# EAGLE board StearnsN2 (EAGLE 6.6.0)
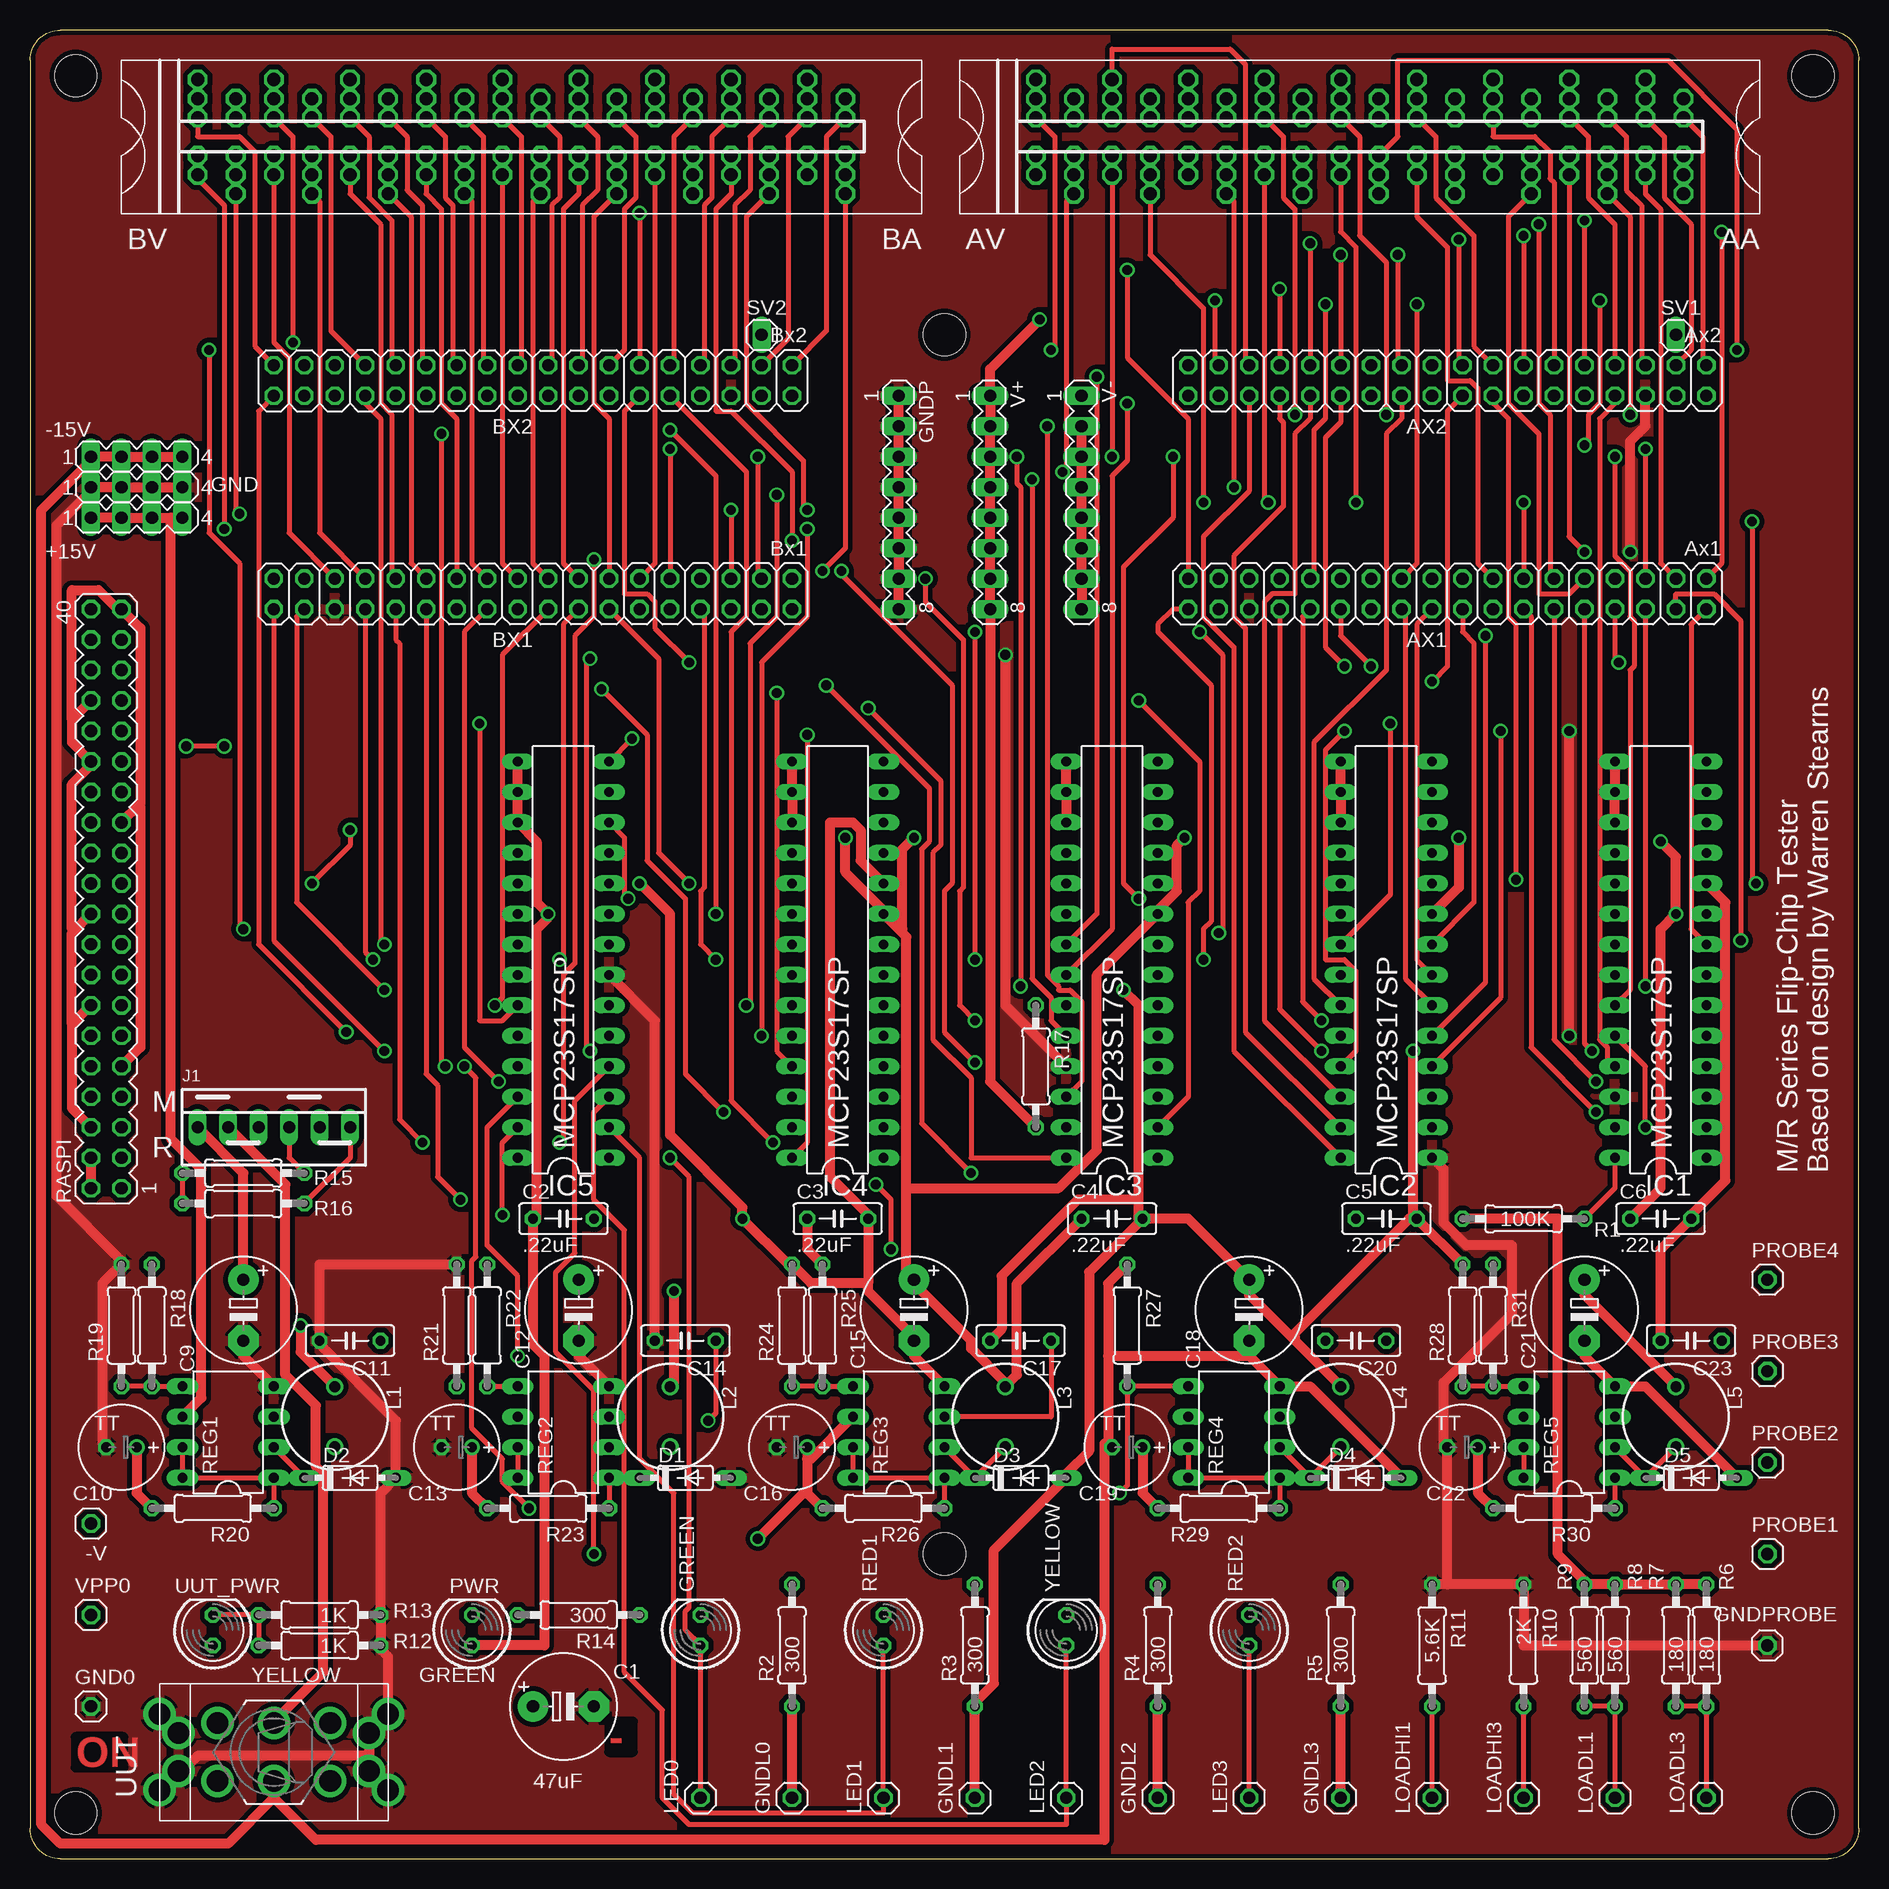
[diagram p1: board, top side]
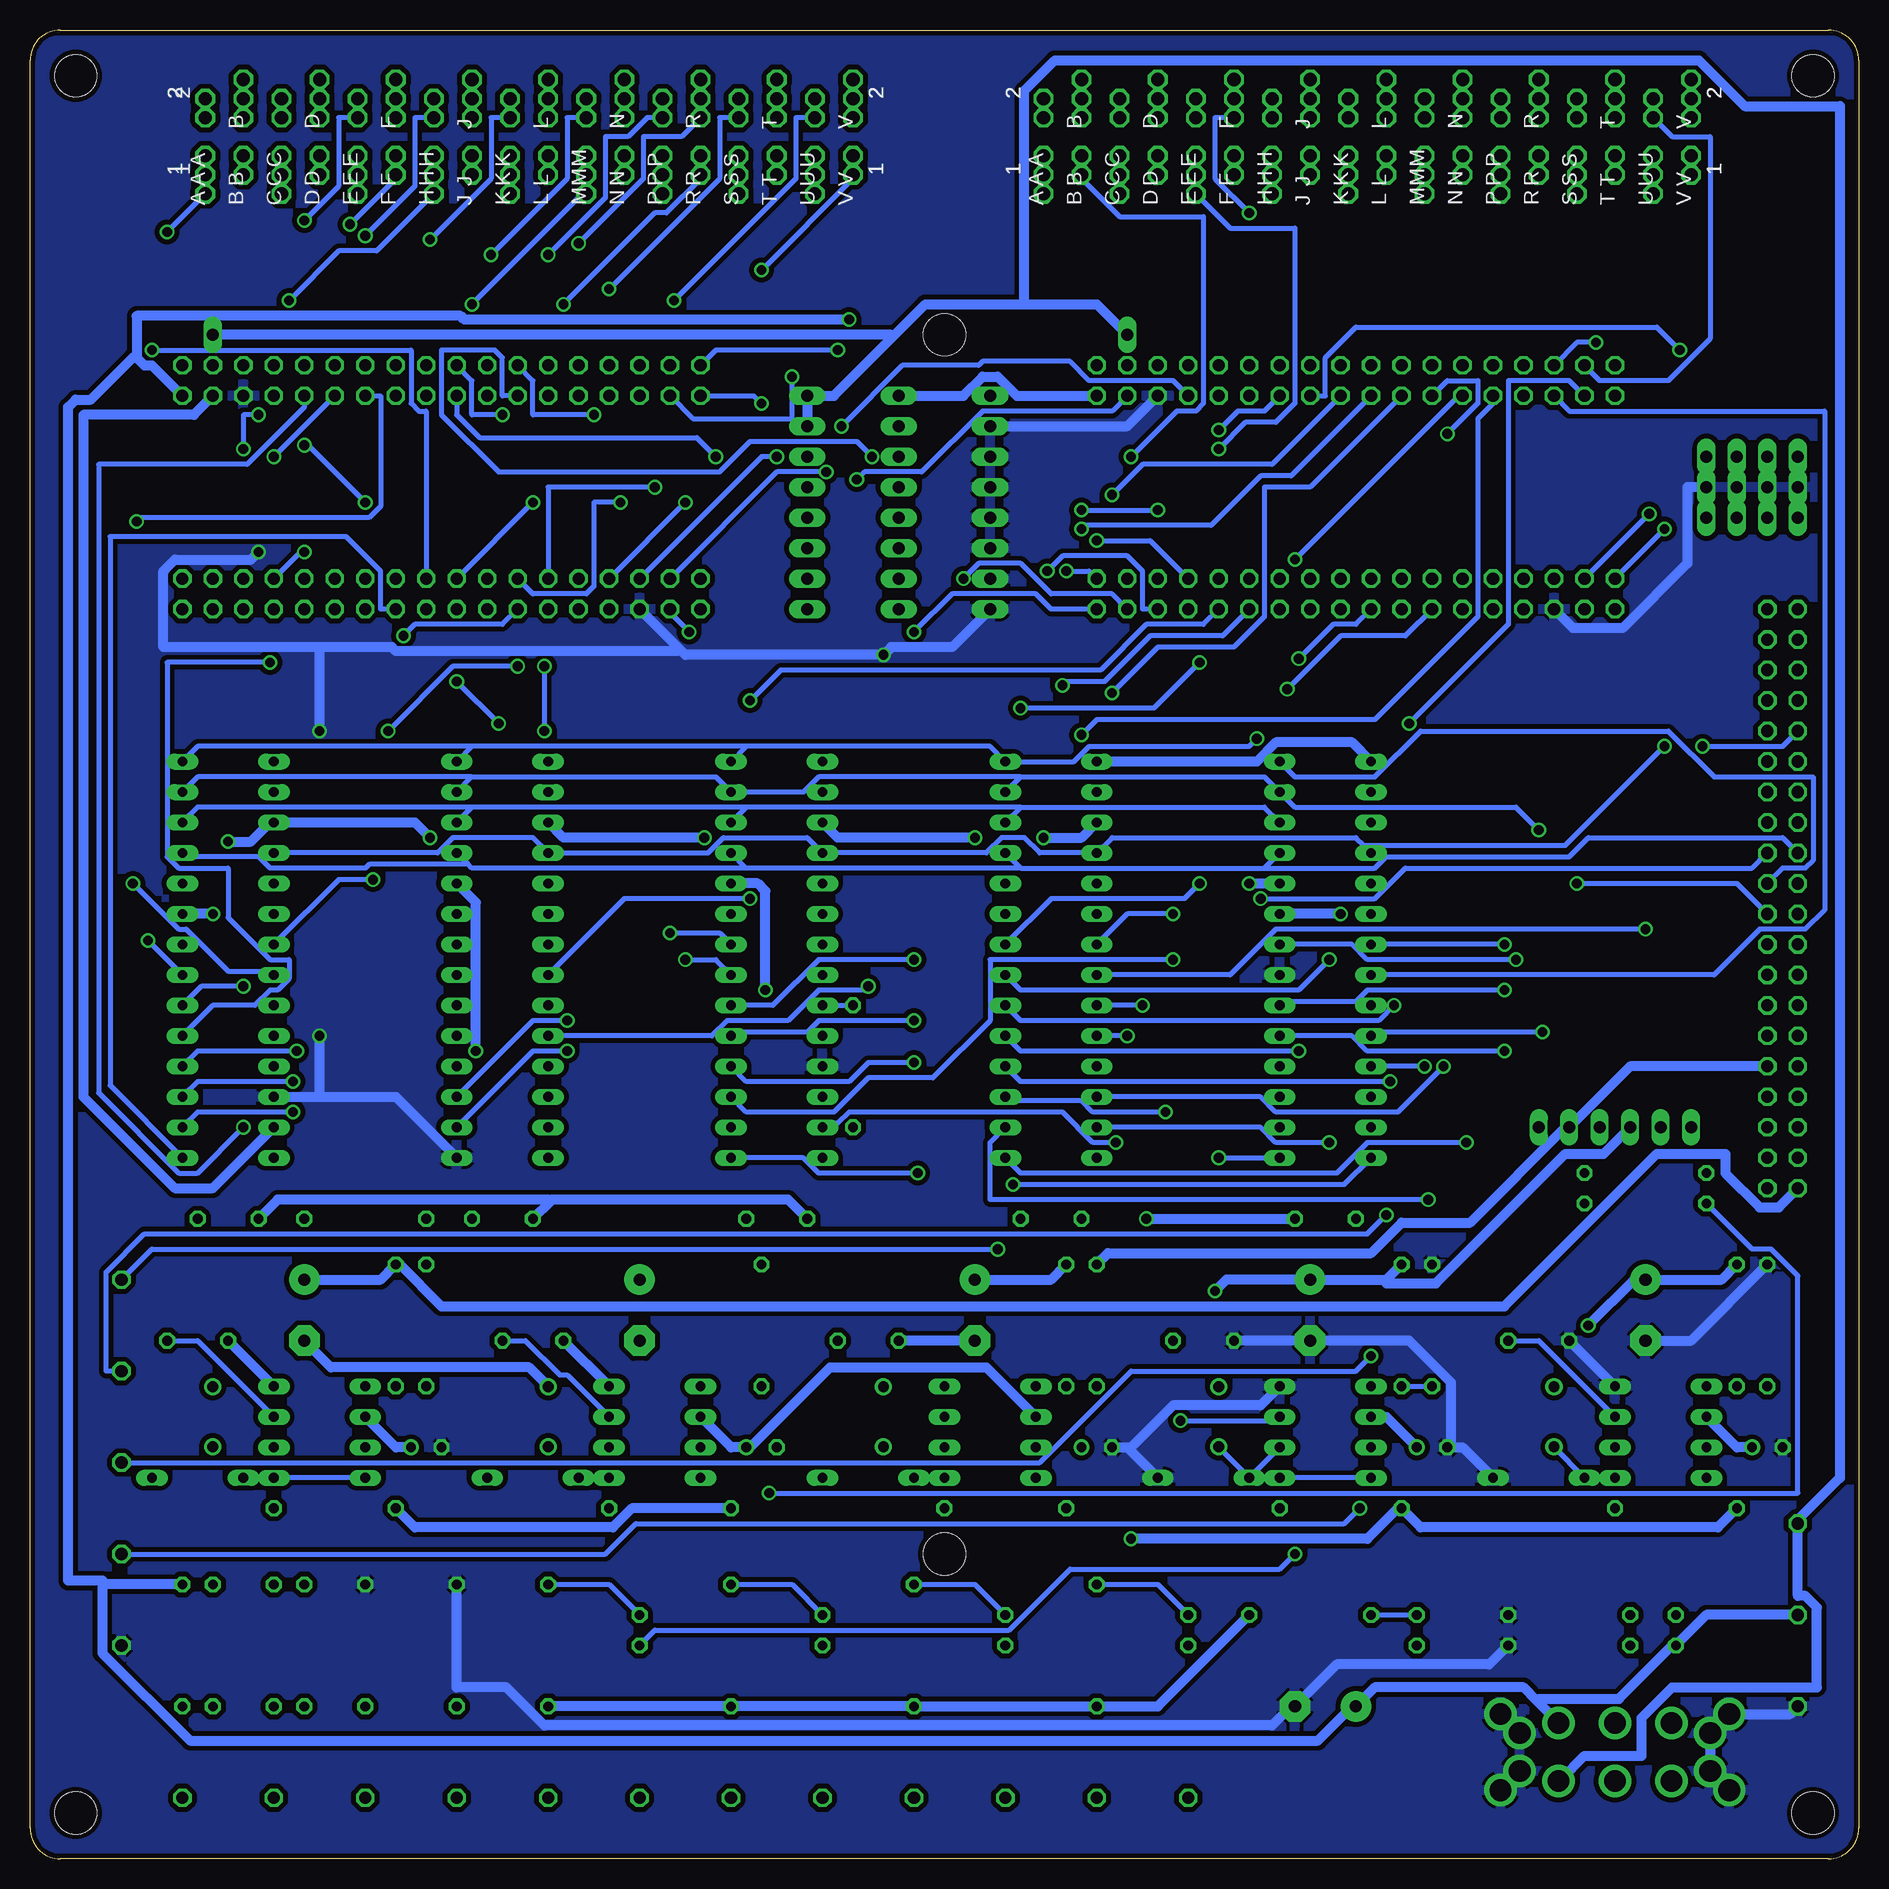
[diagram p2: board, bottom side, seen from below]

Size 152.4 x 152.4 mm. Coordinates in mm from the lower left corner, seen from the top.
Outline: 149.86,152.4 2.54,152.4 arc90 0,149.86 0,2.54 arc90 2.54,0 149.86,0 arc90 152.4,2.54 152.4,149.86 arc90 149.86,152.4
Copper layers (1+16): Top 0.035mm / dielectric 1.5mm / Bottom 0.035mm
Design rules "16mils *": minimum track width 16mil, minimum drill 32mil, track to track 15mil, track to pad 10mil, pad to pad 10mil, via to via 10mil, smd to smd 10mil, copper to edge 13mil, drill to drill 10mil, minimum pad ring 10mil, minimum via ring 8mil, stop-mask expansion 0mil, vias tented up to drill 0mil, thermal gap 10mil
Net classes: 1 Supply: width 0.813 mm
Holes 3.51 mm at 148.59,148.59 3.81,148.59 3.81,3.81 148.59,3.81 76.2,127 76.2,25.4
vRestrict: area 144.8,57.1 to 149.9,97.8

## Footprints (pad centres in the part's own frame; a part is rotated, then mirrored left to right if it is on the bottom)
MA04-1 = drill 1.016 long: 1 -3.81,0; 2 -1.27,0; 3 1.27,0; 4 3.81,0
1X01 = drill 1.016 octagon: 1 0,0
2X18 = drill 1.016 octagon: 1 -21.59,-1.27; 2 -21.59,1.27; 3 -19.05,-1.27; 4 -19.05,1.27; 5 -16.51,-1.27; 6 -16.51,1.27; 7 -13.97,-1.27; 8 -13.97,1.27; 9 -11.43,-1.27; 10 -11.43,1.27; 11 -8.89,-1.27; 12 -8.89,1.27; 13 -6.35,-1.27; 14 -6.35,1.27; 15 -3.81,-1.27; 16 -3.81,1.27; 17 -1.27,-1.27; 18 -1.27,1.27; 19 1.27,-1.27; 20 1.27,1.27; 21 3.81,-1.27; 22 3.81,1.27; 23 6.35,-1.27; 24 6.35,1.27; 25 8.89,-1.27; 26 8.89,1.27; 27 11.43,-1.27; 28 11.43,1.27; 29 13.97,-1.27; 30 13.97,1.27; 31 16.51,-1.27; 32 16.51,1.27; 33 19.05,-1.27; 34 19.05,1.27; 35 21.59,-1.27; 36 21.59,1.27
E5-8,5 = drill 1.016 pad 2.54: + -2.54,0 | drill 1.016 pad 2.54 octagon: - 2.54,0
C050-025X075 = drill 0.813 octagon: 1 -2.54,0; 2 2.54,0
TT2D7 = drill 0.813: + -1.27,0 | drill 0.813 octagon: - 1.27,0
DO35-7 = drill 0.813 long: A 3.81,0; C -3.81,0
H807-2 = drill 1.092 octagon: AA1 4.763,60.325; AA2 -1.587,60.325; AB1 1.587,57.15; AB2 -4.763,57.15; AC1 4.763,53.975; AC2 -1.587,53.975; AD1 1.587,50.8; AD2 -4.763,50.8; AE1 4.763,47.625; AE2 -1.587,47.625; AF1 1.587,44.45; AF2 -4.763,44.45; AH1 4.763,41.275; AH2 -1.587,41.275; AJ1 1.587,38.1; AJ2 -4.763,38.1; AK1 4.763,34.925; AK2 -1.587,34.925; AL1 1.587,31.75; AL2 -4.763,31.75; AM1 4.763,28.575; AM2 -1.587,28.575; AN1 1.587,25.4; AN2 -4.763,25.4; AP1 4.763,22.225; AP2 -1.587,22.225; AR1 1.587,19.05; AR2 -4.763,19.05; AS1 4.763,15.875; AS2 -1.587,15.875; AT1 1.587,12.7; AT2 -4.763,12.7; AU1 4.763,9.525; AU2 -1.587,9.525; AV1 1.587,6.35; AV2 -4.763,6.35; BA1 4.763,-9.525; BA2 -1.587,-9.525; BB1 1.587,-12.7; BB2 -4.763,-12.7; BC1 4.763,-15.875; BC2 -1.587,-15.875; BD1 1.587,-19.05; BD2 -4.763,-19.05; BE1 4.763,-22.225; BE2 -1.587,-22.225; BF1 1.587,-25.4; BF2 -4.763,-25.4; BH1 4.763,-28.575; BH2 -1.587,-28.575; BJ1 1.587,-31.75; BJ2 -4.763,-31.75; BK1 4.763,-34.925; BK2 -1.587,-34.925; BL1 1.587,-38.1; BL2 -4.763,-38.1; BM1 4.763,-41.275; BM2 -1.587,-41.275; BN1 1.587,-44.45; BN2 -4.763,-44.45; BP1 4.763,-47.625; BP2 -1.587,-47.625; BR1 1.587,-50.8; BR2 -4.763,-50.8; BS1 4.763,-53.975; BS2 -1.587,-53.975; BT1 1.587,-57.15; BT2 -4.763,-57.15; BU1 4.763,-60.325; BU2 -1.587,-60.325; BV1 1.587,-63.5; BV2 -4.763,-63.5
ECS2418-2 = drill 1.092 octagon: AA1 1.587,60.325; AA2 -1.587,60.325; AB1 1.587,57.15; AB2 -1.587,57.15; AC1 1.587,53.975; AC2 -1.587,53.975; AD1 1.587,50.8; AD2 -1.587,50.8; AE1 1.587,47.625; AE2 -1.587,47.625; AF1 1.587,44.45; AF2 -1.587,44.45; AH1 1.587,41.275; AH2 -1.587,41.275; AJ1 1.587,38.1; AJ2 -1.587,38.1; AK1 1.587,34.925; AK2 -1.587,34.925; AL1 1.587,31.75; AL2 -1.587,31.75; AM1 1.587,28.575; AM2 -1.587,28.575; AN1 1.587,25.4; AN2 -1.587,25.4; AP1 1.587,22.225; AP2 -1.587,22.225; AR1 1.587,19.05; AR2 -1.587,19.05; AS1 1.587,15.875; AS2 -1.587,15.875; AT1 1.587,12.7; AT2 -1.587,12.7; AU1 1.587,9.525; AU2 -1.587,9.525; AV1 1.587,6.35; AV2 -1.587,6.35; BA1 1.587,-9.525; BA2 -1.587,-9.525; BB1 1.587,-12.7; BB2 -1.587,-12.7; BC1 1.587,-15.875; BC2 -1.587,-15.875; BD1 1.587,-19.05; BD2 -1.587,-19.05; BE1 1.587,-22.225; BE2 -1.587,-22.225; BF1 1.587,-25.4; BF2 -1.587,-25.4; BH1 1.587,-28.575; BH2 -1.587,-28.575; BJ1 1.587,-31.75; BJ2 -1.587,-31.75; BK1 1.587,-34.925; BK2 -1.587,-34.925; BL1 1.587,-38.1; BL2 -1.587,-38.1; BM1 1.587,-41.275; BM2 -1.587,-41.275; BN1 1.587,-44.45; BN2 -1.587,-44.45; BP1 1.587,-47.625; BP2 -1.587,-47.625; BR1 1.587,-50.8; BR2 -1.587,-50.8; BS1 1.587,-53.975; BS2 -1.587,-53.975; BT1 1.587,-57.15; BT2 -1.587,-57.15; BU1 1.587,-60.325; BU2 -1.587,-60.325; BV1 1.587,-63.5; BV2 -1.587,-63.5
EDAC346-36-2 = drill 1.092 octagon: AA1 3.175,60.325; AA2 -3.175,60.325; AB1 3.175,57.15; AB2 -3.175,57.15; AC1 3.175,53.975; AC2 -3.175,53.975; AD1 3.175,50.8; AD2 -3.175,50.8; AE1 3.175,47.625; AE2 -3.175,47.625; AF1 3.175,44.45; AF2 -3.175,44.45; AH1 3.175,41.275; AH2 -3.175,41.275; AJ1 3.175,38.1; AJ2 -3.175,38.1; AK1 3.175,34.925; AK2 -3.175,34.925; AL1 3.175,31.75; AL2 -3.175,31.75; AM1 3.175,28.575; AM2 -3.175,28.575; AN1 3.175,25.4; AN2 -3.175,25.4; AP1 3.175,22.225; AP2 -3.175,22.225; AR1 3.175,19.05; AR2 -3.175,19.05; AS1 3.175,15.875; AS2 -3.175,15.875; AT1 3.175,12.7; AT2 -3.175,12.7; AU1 3.175,9.525; AU2 -3.175,9.525; AV1 3.175,6.35; AV2 -3.175,6.35; BA1 3.175,-9.525; BA2 -3.175,-9.525; BB1 3.175,-12.7; BB2 -3.175,-12.7; BC1 3.175,-15.875; BC2 -3.175,-15.875; BD1 3.175,-19.05; BD2 -3.175,-19.05; BE1 3.175,-22.225; BE2 -3.175,-22.225; BF1 3.175,-25.4; BF2 -3.175,-25.4; BH1 3.175,-28.575; BH2 -3.175,-28.575; BJ1 3.175,-31.75; BJ2 -3.175,-31.75; BK1 3.175,-34.925; BK2 -3.175,-34.925; BL1 3.175,-38.1; BL2 -3.175,-38.1; BM1 3.175,-41.275; BM2 -3.175,-41.275; BN1 3.175,-44.45; BN2 -3.175,-44.45; BP1 3.175,-47.625; BP2 -3.175,-47.625; BR1 3.175,-50.8; BR2 -3.175,-50.8; BS1 3.175,-53.975; BS2 -3.175,-53.975; BT1 3.175,-57.15; BT2 -3.175,-57.15; BU1 3.175,-60.325; BU2 -3.175,-60.325; BV1 3.175,-63.5; BV2 -3.175,-63.5
MA08-1 = drill 1.016 long: 1 -8.89,0; 2 -6.35,0; 3 -3.81,0; 4 -1.27,0; 5 1.27,0; 6 3.81,0; 7 6.35,0; 8 8.89,0
LED5MM = drill 0.813 octagon: A -1.27,0; K 1.27,0
DIL28-3 = drill 0.813 long: 1 -16.51,-3.81; 2 -13.97,-3.81; 3 -11.43,-3.81; 4 -8.89,-3.81; 5 -6.35,-3.81; 6 -3.81,-3.81; 7 -1.27,-3.81; 8 1.27,-3.81; 9 3.81,-3.81; 10 6.35,-3.81; 11 8.89,-3.81; 12 11.43,-3.81; 13 13.97,-3.81; 14 16.51,-3.81; 15 16.51,3.81; 16 13.97,3.81; 17 11.43,3.81; 18 8.89,3.81; 19 6.35,3.81; 20 3.81,3.81; 21 1.27,3.81; 22 -1.27,3.81; 23 -3.81,3.81; 24 -6.35,3.81; 25 -8.89,3.81; 26 -11.43,3.81; 27 -13.97,3.81; 28 -16.51,3.81
22-23-2061 = drill 1 long: 1 -6.35,0; 2 -3.81,0; 3 -1.27,0; 4 1.27,0; 5 3.81,0; 6 6.35,0
6000-XXXX-RC = drill 0.9 pad 1.422: 1 -2.5,0; 2 2.5,0
0207/10 = drill 0.813 octagon: 1 -5.08,0; 2 5.08,0
MA20-2 = drill 1.016 octagon: 1 -24.13,-1.27; 2 -24.13,1.27; 3 -21.59,-1.27; 4 -21.59,1.27; 5 -19.05,-1.27; 6 -19.05,1.27; 7 -16.51,-1.27; 8 -16.51,1.27; 9 -13.97,-1.27; 10 -13.97,1.27; 11 -11.43,-1.27; 12 -11.43,1.27; 13 -8.89,-1.27; 14 -8.89,1.27; 15 -6.35,-1.27; 16 -6.35,1.27; 17 -3.81,-1.27; 18 -3.81,1.27; 19 -1.27,-1.27; 20 -1.27,1.27; 21 1.27,-1.27; 22 1.27,1.27; 23 3.81,-1.27; 24 3.81,1.27; 25 6.35,-1.27; 26 6.35,1.27; 27 8.89,-1.27; 28 8.89,1.27; 29 11.43,-1.27; 30 11.43,1.27; 31 13.97,-1.27; 32 13.97,1.27; 33 16.51,-1.27; 34 16.51,1.27; 35 19.05,-1.27; 36 19.05,1.27; 37 21.59,-1.27; 38 21.59,1.27; 39 24.13,-1.27; 40 24.13,1.27
DIL08 = drill 0.813 long: 1 -3.81,-3.81; 2 -1.27,-3.81; 3 1.27,-3.81; 4 3.81,-3.81; 5 3.81,3.81; 6 1.27,3.81; 7 -1.27,3.81; 8 -3.81,3.81
MA01-1 = drill 1.016 long: 1 0,0
7209MD9V3 = drill 1.803: 1 -2.413,4.699; 2 -2.413,0; 3 -2.413,-4.699; 4 2.413,4.699; 5 2.413,0; 6 2.413,-4.699; NC@1 -3.175,9.525; NC@2 -1.587,7.938; NC@3 3.175,9.525; NC@4 1.587,7.938; NC@5 -3.175,-9.525; NC@6 -1.587,-7.938; NC@7 1.587,-7.938; NC@8 3.175,-9.525

## Placement (x,y rotation side)
+15V  +15V  [MA04-1]  8.89,111.76 0 top
-15V  -15V  [MA04-1]  8.89,116.84 0 top
-V  [1X01]  5.08,27.94 180 top
AX1  Ax1  [2X18]  118.11,105.41 180 top
AX2  Ax2  [2X18]  118.11,123.19 180 top
BX1  Bx1  [2X18]  41.91,105.41 180 top
BX2  Bx2  [2X18]  41.91,123.19 180 top
C1  47uF  [E5-8,5]  44.45,12.7 0 top
C2  .22uF  [C050-025X075]  44.45,53.34 0 top
C3  .22uF  [C050-025X075]  67.31,53.34 0 top
C4  .22uF  [C050-025X075]  90.17,53.34 0 top
C5  .22uF  [C050-025X075]  113.03,53.34 0 top
C6  .22uF  [C050-025X075]  135.89,53.34 0 top
C9  470uF  [E5-8,5]  17.78,45.72 270 top
C10  100uF  [TT2D7]  7.62,34.29 180 top
C11  .22uF  [C050-025X075]  26.67,43.18 180 top
C12  470uF  [E5-8,5]  45.72,45.72 270 top
C13  100uF  [TT2D7]  35.56,34.29 180 top
C14  .22uF  [C050-025X075]  54.61,43.18 180 top
C15  470uF  [E5-8,5]  73.66,45.72 270 top
C16  100uF  [TT2D7]  63.5,34.29 180 top
C17  .22uF  [C050-025X075]  82.55,43.18 180 top
C18  470uF  [E5-8,5]  101.6,45.72 270 top
C19  100uF  [TT2D7]  91.44,34.29 180 top
C20  .22uF  [C050-025X075]  110.49,43.18 180 top
C21  470uF  [E5-8,5]  129.54,45.72 270 top
C22  100uF  [TT2D7]  119.38,34.29 180 top
C23  .22uF  [C050-025X075]  138.43,43.18 180 top
D1  1N5819  [DO35-7]  54.61,31.75 0 top
D2  1N5819  [DO35-7]  26.67,31.75 0 top
D3  1N5819  [DO35-7]  82.55,31.75 0 top
D4  1N5819  [DO35-7]  110.49,31.75 0 top
D5  1N5819  [DO35-7]  138.43,31.75 0 top
DEC  W971  [H807-2]  77.47,143.51 270 top
ECS  W971ECS  [ECS2418-2]  77.47,143.51 270 top
EDAC  W971EDAC  [EDAC346-36-2]  77.47,143.51 270 top
GND  GND  [MA04-1]  8.89,114.3 0 top
GND0  [1X01]  5.08,12.7 0 top
GNDL0  [1X01]  63.5,5.08 90 top
GNDL1  [1X01]  78.74,5.08 90 top
GNDL2  [1X01]  93.98,5.08 90 top
GNDL3  [1X01]  109.22,5.08 90 top
GNDP  GND  [MA08-1]  72.39,113.03 270 top
GNDPROBE  [1X01]  144.78,17.78 180 top
GREEN  [LED5MM]  55.88,19.05 90 top
IC1  MCP23S17SP  [DIL28-3]  135.89,74.93 90 top
IC2  MCP23S17SP  [DIL28-3]  113.03,74.93 90 top
IC3  MCP23S17SP  [DIL28-3]  90.17,74.93 90 top
IC4  MCP23S17SP  [DIL28-3]  67.31,74.93 90 top
IC5  MCP23S17SP  [DIL28-3]  44.45,74.93 90 top
J1  CONFIG  [22-23-2061]  20.32,60.96 0 top
L1  220uH  [6000-XXXX-RC]  25.4,36.83 90 top
L2  220uH  [6000-XXXX-RC]  53.34,36.83 90 top
L3  220uH  [6000-XXXX-RC]  81.28,36.83 90 top
L4  220uH  [6000-XXXX-RC]  109.22,36.83 90 top
L5  220uH  [6000-XXXX-RC]  137.16,36.83 90 top
LED0  [1X01]  55.88,5.08 90 top
LED1  [1X01]  71.12,5.08 90 top
LED2  [1X01]  86.36,5.08 90 top
LED3  [1X01]  101.6,5.08 90 top
LOADHI1  [1X01]  116.84,5.08 90 top
LOADHI3  [1X01]  124.46,5.08 90 top
LOADL1  [1X01]  132.08,5.08 90 top
LOADL3  [1X01]  139.7,5.08 90 top
PROBE1  [1X01]  144.78,25.4 0 top
PROBE2  [1X01]  144.78,33.02 0 top
PROBE3  [1X01]  144.78,40.64 0 top
PROBE4  [1X01]  144.78,48.26 0 top
PWR  GREEN  [LED5MM]  36.83,19.05 90 top
R1  100K  [0207/10]  124.46,53.34 180 top
R2  300  [0207/10]  63.5,17.78 90 top
R3  300  [0207/10]  78.74,17.78 90 top
R4  300  [0207/10]  93.98,17.78 90 top
R5  300  [0207/10]  109.22,17.78 90 top
R6  180  [0207/10]  139.7,17.78 90 top
R7  180  [0207/10]  137.16,17.78 90 top
R8  560  [0207/10]  132.08,17.78 90 top
R9  560  [0207/10]  129.54,17.78 90 top
R10  2K  [0207/10]  124.46,17.78 270 top
R11  5.6K  [0207/10]  116.84,17.78 270 top
R12  1K  [0207/10]  24.13,17.78 180 top
R13  1K  [0207/10]  24.13,20.32 180 top
R14  300  [0207/10]  45.72,20.32 180 top
R15  13.2K  [0207/10]  17.78,57.15 0 top
R16  9.8K  [0207/10]  17.78,54.61 0 top
R17  100K  [0207/10]  83.82,66.04 270 top
R18  1.2K  [0207/10]  7.62,44.45 270 top
R19  3.6K  [0207/10]  10.16,44.45 90 top
R20  0.33  [0207/10]  15.24,29.21 0 top
R21  1.2K  [0207/10]  35.56,44.45 270 top
R22  8.4K  [0207/10]  38.1,44.45 90 top
R23  0.33  [0207/10]  43.18,29.21 0 top
R24  1.2K  [0207/10]  63.5,44.45 270 top
R25  2K  [0207/10]  66.04,44.45 90 top
R26  0.33  [0207/10]  71.12,29.21 0 top
R27  1.2K  [0207/10]  91.44,44.45 270 top
R28  1.2K  [0207/10]  119.38,44.45 270 top
R29  0.33  [0207/10]  99.06,29.21 0 top
R30  0.33  [0207/10]  127,29.21 0 top
R31  3.6K  [0207/10]  121.92,44.45 90 top
RASPI  RasPi  [MA20-2]  6.35,80.01 90 top
RED1  [LED5MM]  71.12,19.05 90 top
RED2  [LED5MM]  101.6,19.05 90 top
REG1  MC33063/MC34063P  [DIL08]  16.51,35.56 90 top
REG2  MC33063/MC34063P  [DIL08]  44.45,35.56 90 top
REG3  MC33063/MC34063P  [DIL08]  72.39,35.56 90 top
REG4  MC33063/MC34063P  [DIL08]  100.33,35.56 90 top
REG5  MC33063/MC34063P  [DIL08]  128.27,35.56 90 top
SV1  MA01-1  [MA01-1]  137.16,127 0 top
SV2  MA01-1  [MA01-1]  60.96,127 0 top
UUT  720X  [7209MD9V3]  20.32,8.89 90 top
UUT_PWR  YELLOW  [LED5MM]  15.24,19.05 90 top
V+  V+  [MA08-1]  80.01,113.03 270 top
V-  V-  [MA08-1]  87.63,113.03 270 top
VPP0  [1X01]  5.08,20.32 0 top
YELLOW  [LED5MM]  86.36,19.05 90 top

## Tracks (layer width: path | path; a pad name or v marks a point on that pad's centre or on a via)
!CE0!/GPIO8
  Bottom 0.406: 49.53,82.55 IC5.11 | 69.85,82.55 49.53,82.55 | IC4.11 69.85,82.55 | 92.71,82.55 IC3.11 | 69.85,82.55 92.71,82.55 | 115.89,82.87 115.57,82.55 92.71,82.55 | 115.89,82.87 IC2.11 | IC1.11 139.38,83.5 133.35,83.5 132.4,82.55 124.46,82.55 124.14,82.87 115.89,82.87 | RASPI.24 6.35,85.09 22.54,85.09 24.13,83.5 39.37,83.5 40.32,82.55 49.53,82.55
!RESET!/GPIO12  (via drill 0.81)
  Top 0.406: v16.19,92.71 v13.02,92.71
  Bottom 0.406: IC1.18 118.43,83.82 117.16,85.09 110.49,85.09 IC2.18 95.89,83.82 94.61,85.09 87.63,85.09 IC3.18 72.71,83.82 71.44,85.09 69.53,85.09 68.26,83.82 IC4.18 62.23,85.09 41.91,85.09 41.27,84.45 | 41.27,84.45 IC5.18 | RASPI.32 6.35,92.71 v13.02,92.71 | v16.19,92.71 24.45,84.45 41.27,84.45
+5V  (via drill 0.81)
  Top 0.813: v22.54,44.45 22.54,42.23 25.4,39.37 L1.2 | J1.1 17.78,57.15 C9.+
  Bottom 0.813: R19.2 11.43,48.26 C9.+ 18.73,48.26 v22.54,44.45
+10V  (via drill 0.81)
  Top 0.813: v53.66,47.31 53.66,39.69 53.34,39.37 L2.2
  Bottom 0.813: 39.37,48.26 R22.2 | 39.37,48.26 C12.+ 52.7,48.26 v53.66,47.31 | J1.3 21.27,58.74 24.45,58.74 35.24,47.94 39.37,47.94 39.37,48.26
+15V  (via drill 0.81)
  Top 0.813: R30.1 120.65,30.48 C22.+ | 64.77,30.48 R26.1 | C16.+ 64.77,33.34 | 64.77,33.34 64.77,30.48 | REG3.6 65.09,33.34 64.77,33.34 | R29.1 92.71,30.48 C19.+ | R23.1 36.83,30.48 C13.+ | +15V.1 +15V.2 +15V.3 11.75,111.76 | 11.75,111.76 +15V.4 | R20.1 8.89,30.48 C10.+ | 11.75,111.76 11.75,60.01 14.29,57.47 14.29,38.42 REG1.6 | v60.64,26.67 64.45,30.48 64.77,30.48
  Bottom 0.813: REG5.6 121.92,34.29 C22.+ | REG4.6 93.98,34.29 C19.+ 92.39,34.29 85.72,40.96 72.71,40.96 REG3.6 | R30.1 120.33,27.62 103.82,27.62 102.23,29.21 R29.1 | C13.+ 39.37,36.83 REG2.6 | REG1.6 10.16,34.29 C10.+ | R20.1 11.75,27.62 36.51,27.62 R23.1 38.42,29.21 40.96,26.67 v60.64,26.67
-15V
  Top 0.813: 101.6,41.91 REG4.4 106.68,39.37 D4.A | C18.- 101.6,41.91 | -15V.4 -15V.3 -15V.2 -15V.1 5.08,116.52 0.95,112.39 0.95,2.86 2.54,1.27 16.51,1.27 20.32,5.08 | 89.85,34.61 C19.- | 89.85,41.91 89.85,47.94 R27.1 | 89.85,41.91 89.85,34.61 | 20.32,5.08 23.81,1.59 89.53,1.59 89.53,34.61 89.85,34.61 | 20.32,5.08 UUT.2 | 89.85,41.91 101.6,41.91
  Bottom 0.813: REG4.4 C20.2
AA1J
  Top 0.406: IC1.8 138.43,77.47 138.43,102.87 AX1.2
AB1J  (via drill 0.81)
  Top 0.406: v142.56,76.52 142.56,103.19 140.34,105.41 137.16,105.41 AX1.4
  Bottom 0.406: v142.56,76.52 IC1.7
AB2J
  Bottom 0.813: IC1.27 137.16,55.88 140.34,55.88 147.96,63.5 147.96,120.33 138.75,120.33 AX2.4
AC1J  (via drill 0.81)
  Top 0.406: AX1.6 v134.62,72.71
  Bottom 0.406: IC1.6 138.11,72.71 v134.62,72.71
AD1J  (via drill 0.81)
  Top 0.406: v132.4,99.69 132.08,100.01 AX1.8
  Bottom 0.406: IC1.5 137.16,71.12 133.67,71.12 132.4,72.39 131.76,72.39 130.81,73.34 130.81,74.93 132.4,74.93 135.89,78.42 135.89,82.55 140.02,82.55 140.97,83.5 140.97,99.69 v132.4,99.69
AD2J
  Top 0.406: IC1.25 131.44,66.67 131.44,67.63 130.81,68.26 130.81,120.02 132.08,121.28 AX2.8
AE1J  (via drill 0.81)
  Top 0.406: v130.18,67.31 129.54,67.94 AX1.10
  Bottom 0.406: IC1.4 138.43,67.31 v130.18,67.31
AE2J  (via drill 0.81)
  Top 0.406: IC1.24 134.62,66.04 v134.62,60.96
  Bottom 0.406: v134.62,60.96 138.43,57.15 140.02,57.15 146.69,63.82 146.69,116.2 134.3,116.2 129.54,120.97 AX2.10
AF1J  (via drill 0.81)
  Top 0.406: v130.49,64.77 127,68.26 AX1.12
  Bottom 0.406: IC1.3 138.43,64.77 v130.49,64.77
AF2J  (via drill 0.81)
  Top 0.406: IC1.23 133.35,72.39 133.35,99.06 133.67,99.38 133.67,103.19 133.35,103.5 133.35,107.31 132.08,108.58 v132.08,116.84
  Bottom 0.406: AX2.12 v132.08,116.84
AH1J  (via drill 0.81)
  Top 0.406: v130.49,62.23 125.09,67.63 125.09,103.5 AX1.14
  Bottom 0.406: IC1.2 138.43,62.23 v130.49,62.23
AH2J  (via drill 0.81)
  Top 0.406: v143.83,81.28 143.51,81.6 v143.51,111.44
  Bottom 0.406: IC1.22 132.4,73.98 135.89,73.98 139.38,77.47 140.02,77.47 v143.83,81.28 | v143.51,111.44 143.19,111.76 124.14,111.76 123.19,112.71 123.19,121.92 AX2.14
AJ1J
  Bottom 0.406: IC1.1 145.73,64.45 145.73,110.17 126.05,110.17 123.19,107.31 123.19,104.14 AX1.16
AJ2J  (via drill 0.81)
  Top 0.406: v123.83,81.6 123.83,102.87 123.19,103.5 123.19,120.02 121.92,121.28 AX2.16
  Bottom 0.406: IC1.21 126.68,81.6 v123.83,81.6
AK1J
  Top 0.406: IC2.8 120.33,79.69 120.33,101.28 119.38,102.23 AX1.18
AK2J  (via drill 0.81)
  Top 0.406: IC2.21 113.35,80.33 v113.35,94.61 | v116.84,98.11 118.11,99.38 118.11,120.65 AX2.18
  Bottom 0.406: v116.84,98.11 v113.35,94.61
AL1J
  Top 0.406: IC2.7 115.57,74.93 115.57,102.87 AX1.20
AL2J  (via drill 0.81)
  Top 0.406: v92.39,80.01 91.12,81.28 91.12,107.63 95.25,111.76 v95.25,116.84
  Bottom 0.406: IC2.22 102.87,80.01 v92.39,80.01 | v95.25,116.84 96.84,118.43 114.94,118.43 116.84,120.33 AX2.20
AM1J
  Top 0.406: IC2.6 114.62,73.34 114.62,103.82 AX1.22
AM2J
  Top 0.406: IC2.23 107,73.34 107,93.03 113.03,99.06 113.03,118.75 114.3,120.02 AX2.22
AN1J  (via drill 0.81)
  Top 0.406: IC2.5 121.28,73.03 v121.28,101.92
  Bottom 0.406: v121.28,101.92 120.33,102.87 113.03,102.87 AX1.24
AN2J  (via drill 0.81)
  Top 0.406: v82.55,72.71 82.55,114.3 82.23,114.62 v82.23,116.84
  Bottom 0.406: IC2.24 95.57,68.58 94.3,69.85 89.22,69.85 86.68,72.39 82.87,72.39 v82.55,72.71 | v82.23,116.84 83.5,118.11 92.39,118.11 94.93,115.57 113.35,115.57 118.11,120.33 118.11,125.73 113.67,125.73 113.03,125.09 113.03,121.92 AX2.24
AP1J  (via drill 0.81)
  Top 0.406: IC2.4 122.56,71.75 v122.56,93.98 | v111.76,99.38 109.22,101.92 AX1.26
  Bottom 0.406: v122.56,93.98 117.16,99.38 v111.76,99.38
AP2J  (via drill 0.81)
  Top 0.406: IC2.25 110.49,67.31 110.49,73.98 109.54,74.93 107.95,74.93 107.95,92.39 v109.54,93.98 | v109.54,99.38 107.95,100.97 107.95,118.43 109.22,119.7 AX2.26
  Bottom 0.406: v109.54,99.38 v109.54,93.98
AR1J  (via drill 0.81)
  Top 0.406: v107.63,69.85 106.05,71.44 106.05,103.5 AX1.28
  Bottom 0.406: IC2.3 110.49,69.85 v107.63,69.85
AR2J
  Top 0.406: IC2.26 102.87,69.85 102.87,104.78 103.5,105.41 105.41,105.41 105.41,118.75 106.68,120.02 AX2.28
AS1J  (via drill 0.81)
  Top 0.406: v107.63,67.31 104.14,70.8 AX1.30
  Bottom 0.406: IC2.2 110.49,67.31 v107.63,67.31
AS2J
  Top 0.406: IC2.27 101.28,68.9 101.28,102.55 100.33,103.5 100.33,108.58 104.46,112.71 104.46,119.7 104.14,120.02 AX2.30
AT2J
  Top 0.406: IC2.28 100.33,67.31 100.33,100.97 97.79,103.5 97.79,110.17 101.6,113.98 AX2.32
AU1J  (via drill 0.81)
  Top 0.406: v99.06,77.15 99.38,77.47 99.38,100.33 v97.47,102.23
  Bottom 0.406: IC3.8 94.93,77.15 v99.06,77.15 | v97.47,102.23 99.06,103.82 AX1.34
AU2J  (via drill 0.81)
  Top 0.406: IC3.21 88.9,78.74 v88.9,123.51
  Bottom 0.406: v88.9,123.51 88.9,120.02 97.16,120.02 AX2.34
AV1J  (via drill 0.81)
  Top 0.406: v97.79,74.93 97.79,77.47 98.42,78.11 98.42,97.79 93.98,102.23 93.98,102.87 95.25,104.14 AX1.36
  Bottom 0.406: IC3.7 95.25,74.93 v97.79,74.93
AV2J  (via drill 0.81)
  Top 0.406: IC3.22 90.17,77.47 90.17,115.25 91.44,116.52 v91.44,121.28
  Bottom 0.406: v91.44,121.28 92.08,121.92 AX2.36
BA1J  (via drill 0.81)
  Top 0.406: v78.74,102.23 v78.74,74.93
  Bottom 0.406: IC3.6 90.49,71.12 86.68,74.93 v78.74,74.93 | v78.74,102.23 75.56,105.41 68.58,105.41 67.31,104.14 BX1.2
BB1J  (via drill 0.81)
  Top 0.406: v78.74,69.85 77.47,71.12 77.47,80.64 77.79,80.96 77.79,101.6 74.61,104.78 v74.61,106.68
  Bottom 0.406: IC3.5 93.66,68.9 87.63,68.9 86.68,69.85 v78.74,69.85 | v74.61,106.68 73.34,107.95 69.85,107.95 67.31,105.41 62.23,105.41 BX1.4
BB2J  (via drill 0.81)
  Top 0.406: IC3.24 85.09,69.85 85.09,71.75 83.5,73.34 v83.5,114.94
  Bottom 0.406: v83.5,114.94 82.87,115.57 78.11,115.57 73.03,120.65 62.23,120.65 BX2.4
BC1J  (via drill 0.81)
  Top 0.406: v78.74,66.36 76.2,68.9 76.2,80.64 76.83,81.28 76.83,97.79 67.63,107 v67.63,107.31
  Bottom 0.406: IC3.4 92.71,64.77 84.14,64.77 82.55,66.36 v78.74,66.36 | v67.63,107.31 66.36,108.58 60.96,108.58 59.69,107.31 59.69,104.14 BX1.6
BD1J  (via drill 0.81)
  Top 0.406: v57.15,74.93 55.88,76.2 55.88,80.64 56.2,80.96 56.2,103.82 BX1.8
  Bottom 0.406: IC3.3 92.71,62.23 85.41,62.23 82.55,65.09 77.15,65.09 72.39,69.85 72.39,74.93 v57.15,74.93
BD2J  (via drill 0.81)
  Top 0.406: IC3.26 87.63,64.77 87.63,71.44 86.68,72.39 85.72,72.39 85.72,72.71 84.77,73.66 v84.77,119.38
  Bottom 0.406: v84.77,119.38 79.69,124.46 73.34,124.46 73.03,124.78 65.72,124.78 64.14,123.19 57.15,123.19 BX2.8
BE1J  (via drill 0.81)
  Top 0.406: IC3.2 96.52,63.5 96.52,79.69 97.47,80.64 97.47,91.44 v92.39,96.52
  Bottom 0.406: v92.39,96.52 89.85,99.06 63.18,99.06 59.37,102.87 54.61,102.87 BX1.10
BE2J  (via drill 0.81)
  Top 0.406: v61.91,59.69 58.42,63.18 58.42,102.23 59.69,103.5 59.69,115.57 BX2.10
  Bottom 0.406: IC3.27 86.04,61.28 85.09,61.28 84.14,62.23 66.36,62.23 63.82,59.69 v61.91,59.69
BF1J  (via drill 0.81)
  Top 0.406: v78.42,57.15 74.3,61.28 74.3,84.14 74.93,84.77 74.93,89.22 v66.36,97.79
  Bottom 0.406: IC3.1 87.95,58.42 86.68,57.15 v78.42,57.15 | v66.36,97.79 66.04,98.11 62.87,98.11 59.05,101.92 53.02,101.92 BX1.12
BF2J  (via drill 0.81)
  Top 0.406: IC3.28 78.42,58.42 78.42,65.09 75.25,68.26 75.25,83.82 75.88,84.45 75.88,89.85 v69.85,95.89 | v54.93,99.69 52.07,102.55 52.07,104.78 51.44,105.41 49.53,105.41 49.53,120.65 BX2.12
  Bottom 0.406: v69.85,95.89 58.74,95.89 v54.93,99.69
BH1J  (via drill 0.81)
  Top 0.406: v54.93,81.28 52.39,83.82 52.39,100.01 BX1.14
  Bottom 0.406: IC4.8 67.31,80.01 56.2,80.01 v54.93,81.28
BH2J  (via drill 0.81)
  Top 0.406: v57.15,78.74 57.15,115.25 v53.34,119.06
  Bottom 0.406: IC4.21 60.96,78.74 v57.15,78.74 | v53.34,119.06 51.75,120.65 49.53,120.65 BX2.14
BJ1J  (via drill 0.81)
  Top 0.406: v44.13,74.93 44.45,75.25 44.45,102.87 BX1.16
  Bottom 0.406: IC4.7 69.85,72.39 46.67,72.39 v44.13,74.93
BJ2J  (via drill 0.81)
  Top 0.406: v17.78,77.47 17.46,77.79 17.46,107.95 14.92,110.49 v14.92,125.73
  Bottom 0.406: IC4.22 52.39,73.66 48.58,77.47 v17.78,77.47 | v14.92,125.73 16.83,127.64 41.91,127.64 44.45,125.09 44.45,121.92 BX2.16
BK1J  (via drill 0.81)
  Top 0.406: v38.73,71.12 39.37,71.75 39.37,100.33 BX1.18
  Bottom 0.406: IC4.6 69.85,69.85 40.01,69.85 v38.73,71.12
BK2J  (via drill 0.81)
  Top 0.406: v59.69,71.12 60.01,71.44 60.01,101.28 62.23,103.5 v62.23,113.67
  Bottom 0.406: v59.69,71.12 IC4.23 | v62.23,113.67 59.69,116.2 48.9,116.2 BX2.18
BL1J  (via drill 0.81)
  Top 0.406: v46.67,67.31 46.35,67.63 46.35,99.69 v46.67,100.01
  Bottom 0.406: IC4.5 69.85,67.31 v46.67,67.31 | v46.67,100.01 43.81,102.87 41.91,102.87 BX1.20
BL2J  (via drill 0.81)
  Top 0.406: v60.96,68.58 60.96,99.69 64.77,103.5 v64.77,110.81
  Bottom 0.406: v60.96,68.58 IC4.24 | v64.77,110.81 64.45,111.12 53.98,111.12 49.85,115.25 47.31,115.25 BX2.20
BM1J  (via drill 0.81)
  Top 0.406: v39.05,64.77 36.2,67.63 36.2,102.23 BX1.22
  Bottom 0.406: IC4.4 69.85,64.77 v39.05,64.77
BM2J  (via drill 0.81)
  Top 0.406: IC4.25 62.23,67.31 v62.23,97.16
  Bottom 0.406: v62.23,97.16 58.42,100.97 52.07,100.97 49.53,103.5 49.53,114.3 45.72,114.3 BX2.22
BN1J  (via drill 0.81)
  Top 0.406: v57.78,62.23 54.61,65.41 54.61,80.01 51.44,83.19 51.44,93.66 v47.62,97.47
  Bottom 0.406: IC4.3 70.8,63.18 64.77,63.18 63.82,62.23 v57.78,62.23 | v47.62,97.47 43.18,101.92 37.78,101.92 BX1.24
BN2J  (via drill 0.81)
  Top 0.406: v34.61,66.04 34.29,66.36 v34.29,118.75
  Bottom 0.406: IC4.26 49.85,63.5 48.58,62.23 38.42,62.23 v34.61,66.04 | v34.29,118.75 31.75,121.28 31.75,123.19 34.29,123.19 BX2.24
BP1J  (via drill 0.81)
  Top 0.406: v35.88,54.93 33.97,56.83 33.97,64.45 33.02,65.41 BX1.26
  Bottom 0.406: IC4.2 72.39,59.69 72.39,54.93 v35.88,54.93
BP2J  (via drill 0.81)
  Top 0.406: v44.13,59.69 44.45,60.01 44.45,73.66 45.4,74.61 45.4,101.92 46.99,103.5 v46.99,108.27
  Bottom 0.406: IC4.27 49.85,60.96 48.58,59.69 v44.13,59.69 | v46.99,108.27 33.34,121.92 BX2.26
BR1J  (via drill 0.81)
  Top 0.406: v32.7,59.69 30.8,61.59 30.8,101.28 30.48,101.6 BX1.28
  Bottom 0.406: IC4.1 69.85,57.15 43.5,57.15 40.96,59.69 v32.7,59.69
BR2J  (via drill 0.81)
  Top 0.406: IC4.28 64.77,59.69 v64.77,93.66
  Bottom 0.406: v64.77,93.66 63.5,94.93 40.32,94.93 31.75,103.5 31.75,120.02 30.48,121.28 BX2.28
BS1J  (via drill 0.81)
  Top 0.406: v28.57,74.93 27.94,75.56 BX1.30
  Bottom 0.406: IC5.8 42.23,76.2 40.96,74.93 v28.57,74.93
BS2J  (via drill 0.81)
  Top 0.406: v29.53,76.2 29.21,76.52 29.21,120.02 27.94,121.28 BX2.30
  Bottom 0.406: v29.53,76.2 IC5.21
BT2J
  Bottom 0.406: IC5.22 12.06,73.66 8.26,77.47 4.45,77.47 2.86,79.06 2.86,120.65 24.13,120.65 BX2.32
BU1J  (via drill 0.81)
  Top 0.406: v29.53,72.39 22.23,79.69 22.23,103.5 BX1.34
  Bottom 0.406: IC5.6 47.94,71.44 41.91,71.44 40.96,72.39 v29.53,72.39
BU2J  (via drill 0.81)
  Top 0.406: IC5.23 39.37,69.85 37.47,69.85 v37.47,94.61
  Bottom 0.406: v37.47,94.61 29.21,102.87 29.21,123.19 24.13,123.19 BX2.34
BV1J  (via drill 0.81)
  Top 0.406: v29.53,67.31 20.32,76.52 BX1.36
  Bottom 0.406: IC5.5 42.23,68.58 40.96,67.31 v29.53,67.31
BV2J  (via drill 0.81)
  Top 0.406: v26.35,68.9 19.05,76.2 19.05,120.65 BX2.36
  Bottom 0.406: IC5.24 40.32,68.9 v26.35,68.9
CLK/GPIO11  (via drill 0.81)
  Top 0.406: v49.85,80.01 49.53,80.33 49.53,85.09 IC5.12
  Bottom 0.406: IC5.12 49.53,87.63 69.85,87.63 | IC4.12 69.85,87.63 | 92.71,87.63 IC3.12 | 69.85,87.63 92.71,87.63 | 115.57,87.63 IC2.12 | 92.71,87.63 115.57,87.63 | IC1.12 138.43,87.63 115.57,87.63 | RASPI.23 8.89,82.55 37.78,82.55 40.32,80.01 v49.85,80.01
GND  (via drill 0.81)
  Top 0.813: GNDP.1 GNDP.2 GNDP.3 GNDP.4 GNDP.5 GNDP.6 GNDP.7 GNDP.8 | IC3.25 81.28,71.12 v81.28,100.33 | AX2.6 134.62,119.38 133.35,118.11 v133.35,108.9 | GND.4 GND.3 GND.2 GND.1 5.08,113.98 2.22,111.12 2.22,55.24 7.62,49.85 R18.1 6.03,47.94 6.03,34.61 C10.- | REG1.4 17.78,41.91 C9.- | R21.1 24.13,49.53 C11.2 24.13,42.86 30.48,36.51 D2.A 29.21,30.48 R13.1 R12.1 29.21,17.46 29.84,16.83 UUT.NC@8 29.53,12.06 29.53,11.75 UUT.NC@7 UUT.NC@6 | 118.11,22.86 R10.1 124.46,17.78 GNDPROBE.1 | 118.11,22.86 R11.1 | 118.11,22.86 C22.- 117.79,34.29 117.79,39.69 123.51,45.4 123.51,51.12 119.7,51.12 117.79,53.02 117.79,57.47 IC2.1 | REG2.4 45.72,41.91 C12.- | IC5.7 52.07,69.85 C14.2 | UUT.NC@1 UUT.NC@2 12.7,7.3 13.97,8.57 27.94,8.57 UUT.NC@6 | UUT.NC@5 UUT.NC@6 | v128.27,68.58 v128.27,93.98
  Bottom 0.813: BX2.6 60.96,119.38 GNDP.2 | GNDP.8 75.56,100.97 80.64,100.97 v81.28,100.33 97.79,100.33 98.27,100.81 | 98.27,100.81 AX1.32 | v133.35,108.9 133.99,108.27 140.34,108.27 141.29,107.31 141.29,100.97 128.27,100.97 | 128.27,100.97 122.24,100.97 121.92,100.65 98.42,100.65 98.27,100.81 | BX1.32 23.81,102.55 19.68,102.55 14.29,107.95 14.29,114.3 GND.4 | REG1.4 C11.2 | R18.1 13.97,43.18 C9.- | IC2.1 121.92,63.5 128.27,63.5 | IC1.26 128.27,63.5 | 60.8,34.13 60.96,34.29 C16.- | 60.8,34.13 D1.A | C14.2 C12.- 37.47,43.18 33.97,39.69 33.97,34.61 C13.- 33.02,34.29 D2.A | 60.8,34.13 57.15,37.78 49.85,37.78 REG2.4 | GND0.1 5.71,12.06 UUT.NC@3 10.79,11.75 11.11,11.75 UUT.NC@4 UUT.NC@2 | R12.1 30.8,16.19 43.5,16.19 C1.- 47.31,12.7 48.9,11.11 109.54,11.11 112.71,14.29 116.84,14.29 R11.1 | v128.27,93.98 128.27,100.97 | 128.27,63.5 v128.27,68.58
  pour Top (isolate 0.406): 152.4,152.4 0,152.4 0,0 152.4,0
  pour Bottom (isolate 0.406): 152.4,152.4 0,152.4 0,0 152.4,0
LED0  (via drill 0.81)
  Top 0.406: LED0.1 GREEN.A 54.61,19.05 54.61,20.64 54.93,20.95 54.93,56.83 v53.34,58.42
  Bottom 0.406: v53.34,58.42 IC5.1
LED1
  Top 0.406: RED1.A LED1.1 71.12,3.81 55.24,3.81 53.66,5.4 53.66,30.48 50.8,33.34 50.8,58.42 IC5.2
LED2
  Top 0.406: YELLOW.A LED2.1 86.36,2.86 54.93,2.86 52.7,5.08 52.7,12.38 49.53,15.56 49.53,52.39 46.99,54.93 46.99,62.23 IC5.3
LED3  (via drill 0.81)
  Top 0.406: LED3.1 RED2.A | IC5.4 45.4,63.18 45.4,50.48 43.81,48.9 43.81,42.23 46.99,39.05 v46.99,25.4
  Bottom 0.406: v46.99,25.4 48.26,24.13 65.72,24.13 70.8,19.05 100.33,19.05 RED2.A
N$1  (via drill 0.81)
  Top 0.406: ECS.AA1 EDAC.AA1 DEC.AA1 | AX1.1 140.97,107.95 v140.97,135.57
  Bottom 0.406: DEC.AA1 v140.97,135.57
N$2  (via drill 0.81)
  Top 0.406: AX1.35 96.52,120.02 91.44,125.09 v91.44,132.4 | EDAC.AV1 ECS.AV1
  Bottom 0.406: v91.44,132.4 83.82,140.02 EDAC.AV1
N$3  (via drill 0.81)
  Top 0.406: ECS.AU1 EDAC.AU1 DEC.AU1 86.36,138.11 86.36,115.89 v86.04,115.57
  Bottom 0.406: AX1.33 90.17,115.57 v86.04,115.57
N$4  (via drill 0.81)
  Top 0.406: v90.17,116.84 EDAC.AT1 ECS.AT1
  Bottom 0.406: AX1.31 91.44,116.84 v90.17,116.84
N$5  (via drill 0.81)
  Top 0.406: ECS.AS1 EDAC.AS1 DEC.AS1 93.34,133.67 97.79,129.22 v97.79,113.03
  Bottom 0.406: v97.79,113.03 AX1.29
N$6  (via drill 0.81)
  Top 0.406: AX1.27 107,107 107,119.06 107.95,120.02 v107.95,129.54 | EDAC.AR1 ECS.AR1
  Bottom 0.406: v107.95,129.54 100.33,137.16 99.38,137.16 96.52,140.02 EDAC.AR1
N$7  (via drill 0.81)
  Top 0.406: ECS.AP1 EDAC.AP1 DEC.AP1 100.33,138.11 v100.33,114.3
  Bottom 0.406: AX1.25 109.22,114.3 v100.33,114.3
N$8  (via drill 0.81)
  Top 0.406: v103.19,113.03 102.87,113.35 EDAC.AN1 ECS.AN1
  Bottom 0.406: AX1.23 110.49,105.41 106.05,105.41 105.41,106.05 105.41,113.03 v103.19,113.03
N$9  (via drill 0.81)
  Top 0.406: ECS.AM1 EDAC.AM1 DEC.AM1 | AX1.21 115.57,107.95 v115.57,129.54
  Bottom 0.406: v115.57,129.54 106.36,138.75 DEC.AM1
N$10  (via drill 0.81)
  Top 0.406: v110.49,113.03 110.49,134.3 109.22,135.57 EDAC.AL1 ECS.AL1
  Bottom 0.406: v110.49,113.03 AX1.19
N$11  (via drill 0.81)
  Top 0.406: DEC.AK1 EDAC.AK1 ECS.AK1 113.98,143.51 113.98,149.86 136.53,149.86 142.24,144.15 v142.24,125.73
  Bottom 0.406: AX1.17 119.38,120.65 120.02,120.65 120.65,121.28 120.65,125.73 v142.24,125.73
N$12
  Top 0.406: AX1.15 120.65,107.95 120.65,122.56 120.02,123.19 118.11,123.19 118.11,134.3 115.57,136.84 EDAC.AJ1 ECS.AJ1
N$13  (via drill 0.81)
  Top 0.406: ECS.AH1 EDAC.AH1 DEC.AH1 | v124.46,113.03 AX1.13 | v129.54,117.79 129.86,118.11 129.86,120.33 130.81,121.28 v130.81,129.86
  Bottom 0.406: v124.46,113.03 129.22,117.79 v129.54,117.79 | v130.81,129.86 126.68,133.99 123.51,133.99 DEC.AH1
N$14  (via drill 0.81)
  Top 0.406: AX1.11 126.68,107 126.68,120.33 125.73,121.28 v125.73,136.21 | EDAC.AF1 ECS.AF1
  Bottom 0.406: v125.73,136.21 121.92,140.02 EDAC.AF1
N$15
  Top 0.406: ECS.AE1 EDAC.AE1 DEC.AE1 123.19,136.84 123.19,121.28 125.73,118.75 125.73,105.41 128.27,105.41 AX1.9
N$16  (via drill 0.81)
  Top 0.406: v129.54,108.9 128.27,110.17 EDAC.AD1 ECS.AD1
  Bottom 0.406: AX1.7 129.86,108.9 v129.54,108.9
N$17  (via drill 0.81)
  Top 0.406: ECS.AC1 EDAC.AC1 DEC.AC1 133.35,136.84 v133.35,120.33 | v134.62,117.47 AX1.5
  Bottom 0.406: v134.62,117.47 134.62,120.33 v133.35,120.33
N$18
  Top 0.406: AX1.3 135.89,107.95 135.89,137.48 134.62,138.75 EDAC.AB1 ECS.AB1
N$19
  Top 0.406: AX2.1 139.38,124.78 139.38,143.51 ECS.AA2 EDAC.AA2
N$20
  Top 0.406: DEC.AB2 EDAC.AB2 ECS.AB2 136.21,143.51 136.21,138.43 138.43,136.21 138.43,125.73 AX2.3
N$21
  Top 0.406: AX2.5 134.3,124.78 134.3,137.79 133.03,139.06 133.03,143.51 ECS.AC2 EDAC.AC2
N$22
  Top 0.406: DEC.AD2 EDAC.AD2 ECS.AD2 129.86,143.51 129.86,138.43 132.08,136.21 AX2.7
N$23  (via drill 0.81)
  Top 0.406: v129.54,136.53 AX2.9 | ECS.AE2 EDAC.AE2
  Bottom 0.406: v129.54,136.53 126.68,139.38 126.68,145.1 ECS.AE2
N$24
  Top 0.406: DEC.AF2 EDAC.AF2 ECS.AF2 121.92,143.51 125.41,143.51 126.68,142.24 126.68,140.02 127,139.7 AX2.11
N$25  (via drill 0.81)
  Top 0.406: v124.46,135.25 AX2.13 | ECS.AH2 EDAC.AH2
  Bottom 0.406: v124.46,135.25 120.33,139.38 120.33,145.1 ECS.AH2
N$26
  Top 0.406: DEC.AJ2 EDAC.AJ2 ECS.AJ2 117.16,143.51 117.16,138.43 120.33,135.25 120.33,126.05 AX2.15
N$27  (via drill 0.81)
  Top 0.406: AX2.17 119.06,124.78 v119.06,134.94 | ECS.AK2 EDAC.AK2
  Bottom 0.406: v119.06,134.94 113.98,140.02 113.98,145.1 ECS.AK2
N$28  (via drill 0.81)
  Top 0.406: DEC.AL2 EDAC.AL2 ECS.AL2 110.81,143.51 110.81,135.25 113.03,133.03 v113.03,120.33
  Bottom 0.406: AX2.19 115.57,123.19 115.57,120.33 v113.03,120.33
N$29  (via drill 0.81)
  Top 0.406: AX2.21 113.98,124.78 v113.98,133.67 | ECS.AM2 EDAC.AM2
  Bottom 0.406: v113.98,133.67 107.63,140.02 107.63,145.1 ECS.AM2
N$30  (via drill 0.81)
  Top 0.406: DEC.AN2 EDAC.AN2 ECS.AN2 104.46,143.51 104.46,138.43 105.41,137.48 v105.41,120.33
  Bottom 0.406: AX2.23 110.49,123.19 110.49,120.33 v105.41,120.33
N$31  (via drill 0.81)
  Top 0.406: v109.22,133.67 AX2.25 | ECS.AP2 EDAC.AP2
  Bottom 0.406: v109.22,133.67 104.46,138.43 104.46,143.51 102.55,143.51 100.97,145.1 ECS.AP2
N$32  (via drill 0.81)
  Top 0.406: DEC.AR2 EDAC.AR2 ECS.AR2 | v106.68,134.62 AX2.27
  Bottom 0.406: v106.68,134.62 101.28,140.02 101.28,143.51 98.11,143.51 ECS.AR2
N$33  (via drill 0.81)
  Top 0.406: v104.14,130.81 AX2.29 | ECS.AS2 EDAC.AS2
  Bottom 0.406: v104.14,130.81 94.93,140.02 94.93,145.1 ECS.AS2
N$34
  Top 0.406: ECS.AT2 EDAC.AT2 DEC.AT2 90.17,150.81 100.01,150.81 101.28,149.54 101.28,124.78 AX2.31
N$35  (via drill 0.81)
  Top 0.406: AX2.33 98.74,124.78 v98.74,129.86 | ECS.AU2 EDAC.AU2
  Bottom 0.406: v98.74,129.86 88.58,140.02 88.58,145.1 ECS.AU2
N$36  (via drill 0.81)
  Top 0.406: DEC.AV2 EDAC.AV2 ECS.AV2 85.41,143.51 85.41,126.05 v85.09,125.73
  Bottom 0.406: AX2.35 95.25,125.73 v85.09,125.73
N$37
  Top 0.406: BX2.1 66.36,127.32 66.36,143.51 ECS.BA2 EDAC.BA2
N$38
  Top 0.406: DEC.BB2 EDAC.BB2 ECS.BB2 63.18,143.51 63.18,126.68 BX2.3
N$39
  Top 0.406: BX2.5 58.74,124.78 58.74,137.79 60.01,139.06 60.01,143.51 ECS.BC2 EDAC.BC2
N$40
  Top 0.406: DEC.BD2 EDAC.BD2 ECS.BD2 56.83,143.51 56.83,138.43 56.2,137.79 56.2,124.78 BX2.7
N$41
  Top 0.406: BX2.9 53.66,124.78 53.66,143.51 ECS.BE2 EDAC.BE2
N$42  (via drill 0.81)
  Top 0.406: DEC.BF2 EDAC.BF2 ECS.BF2 | v50.8,137.16 BX2.11
  Bottom 0.406: v50.8,137.16 53.66,140.02 53.66,145.1 ECS.BF2
N$43
  Top 0.406: BX2.13 49.53,125.73 49.53,137.48 50.48,138.43 50.48,143.51 ECS.BH2 EDAC.BH2
N$44
  Top 0.406: DEC.BJ2 EDAC.BJ2 ECS.BJ2 47.31,143.51 47.31,139.06 46.04,137.79 46.04,124.78 BX2.15
N$45
  Top 0.406: BX2.17 43.5,124.78 43.5,137.79 44.13,138.43 44.13,143.51 ECS.BK2 EDAC.BK2
N$46
  Top 0.406: DEC.BL2 EDAC.BL2 ECS.BL2 40.96,143.51 40.96,124.78 BX2.19
N$47
  Top 0.406: BX2.21 37.78,124.78 37.78,143.51 ECS.BM2 EDAC.BM2
N$48
  Top 0.406: DEC.BN2 EDAC.BN2 ECS.BN2 34.61,143.51 34.61,138.43 35.24,137.79 35.24,124.78 BX2.23
N$49
  Top 0.406: BX2.25 32.7,124.78 32.7,137.79 31.43,139.06 31.43,143.51 ECS.BP2 EDAC.BP2
N$50
  Top 0.406: DEC.BR2 EDAC.BR2 ECS.BR2 28.26,143.51 28.26,138.43 30.16,136.53 30.16,124.78 BX2.27
N$51
  Top 0.406: BX2.29 25.08,127.32 25.08,143.51 ECS.BS2 EDAC.BS2
N$52  (via drill 0.81)
  Top 0.406: DEC.BT2 EDAC.BT2 ECS.BT2 21.91,143.51 v21.91,126.36
  Bottom 0.406: BX2.31 23.5,126.36 v21.91,126.36
N$53
  Top 0.406: ECS.BU2 EDAC.BU2
  Bottom 0.406: BX2.33 21.59,123.19 15.88,123.19 12.38,126.68 12.38,143.51 15.56,143.51 ECS.BU2
N$54
  Top 0.406: DEC.BV2 EDAC.BV2 ECS.BV2 13.97,143.51 17.46,143.51 18.73,142.24 18.73,126.05 BX2.35
N$55  (via drill 0.81)
  Top 0.406: ECS.BA1 EDAC.BA1 DEC.BA1 67.94,109.22 v66.04,107.31
  Bottom 0.406: BX1.1 64.14,107.31 v66.04,107.31
N$56  (via drill 0.81)
  Top 0.406: BX1.3 60.64,107 v60.64,116.84 | EDAC.BB1 ECS.BB1
  Bottom 0.406: v60.64,116.84 56.83,120.65 55.24,120.65 54.61,121.28 54.61,136.84 61.59,136.84 64.77,140.02 EDAC.BB1
N$57  (via drill 0.81)
  Top 0.406: ECS.BC1 EDAC.BC1 DEC.BC1 59.69,136.84 59.69,121.28 64.45,116.52 64.45,112.71 v64.77,112.39 | v58.42,112.39 BX1.5
  Bottom 0.406: v64.77,112.39 v58.42,112.39
N$58  (via drill 0.81)
  Top 0.406: v63.5,109.86 63.5,115.57 58.42,120.65 57.15,120.65 57.15,137.48 58.42,138.75 EDAC.BD1 ECS.BD1
  Bottom 0.406: BX1.7 59.05,109.86 v63.5,109.86
N$59  (via drill 0.81)
  Top 0.406: ECS.BE1 EDAC.BE1 DEC.BE1 | v53.34,117.47 BX1.9
  Bottom 0.406: v53.34,117.47 51.12,119.7 48.58,119.7 46.99,121.28 46.99,135.89 52.39,135.89 DEC.BE1
N$60
  Top 0.406: BX1.11 52.07,107.95 EDAC.BF1 ECS.BF1
N$61
  Top 0.406: ECS.BH1 EDAC.BH1 DEC.BH1 46.99,136.84 46.99,121.28 48.26,120.02 BX1.13
N$62
  Top 0.406: BX1.15 44.45,107.95 44.45,137.48 45.72,138.75 EDAC.BJ1 ECS.BJ1
N$63
  Top 0.406: ECS.BK1 EDAC.BK1 DEC.BK1 41.91,138.11 41.91,107.95 BX1.17
N$64
  Top 0.406: BX1.19 39.37,107.95 EDAC.BL1 ECS.BL1
N$65
  Top 0.406: ECS.BM1 EDAC.BM1 DEC.BM1 36.83,138.11 36.83,107.95 BX1.21
N$66
  Top 0.406: BX1.23 35.56,120.02 34.29,121.28 34.29,137.48 33.02,138.75 EDAC.BN1 ECS.BN1
N$67
  Top 0.406: ECS.BP1 EDAC.BP1 DEC.BP1 31.75,136.84 31.75,107.95 BX1.25
N$68
  Top 0.406: BX1.27 30.16,107 30.16,120.33 29.21,121.28 29.21,136.21 26.67,138.75 EDAC.BR1 ECS.BR1
N$69
  Top 0.406: ECS.BS1 EDAC.BS1 DEC.BS1 24.13,138.11 24.13,110.49 BX1.29
N$70
  Top 0.406: BX1.31 21.59,110.49 21.59,125.09 20.32,126.36 EDAC.BT1 ECS.BT1
N$71  (via drill 0.81)
  Top 0.406: ECS.BU1 EDAC.BU1 DEC.BU1 17.14,112.39 v17.46,112.08
  Bottom 0.406: v17.46,112.08 BX1.33
N$72  (via drill 0.81)
  Top 0.406: v16.19,110.81 16.19,137.79 13.97,140.02 EDAC.BV1 ECS.BV1
  Bottom 0.406: v16.19,110.81 BX1.35
N$73
  Bottom 0.406: GREEN.K 58.42,22.86 R2.2
N$74
  Bottom 0.406: RED1.K 73.66,22.86 R3.2
N$75
  Bottom 0.406: YELLOW.K 88.9,22.86 R4.2
N$76
  Bottom 0.406: RED2.K 104.14,22.86 R5.2
N$77
  Top 0.406: R7.1 R6.1 LOADL3.1
N$78
  Top 0.406: R9.1 R8.1 LOADL1.1
N$79
  Top 0.406: LOADHI1.1 R11.2
N$80
  Top 0.406: LOADHI3.1 R10.2
N$81
  Bottom 0.406: IC3.23 R17.1
N$82
  Top 0.406: UUT_PWR.K R13.2 R12.2
N$83
  Bottom 0.406: R14.2 PWR.K
N$85
  Top 0.406: R15.2 21.59,58.42 J1.4
N$86
  Top 0.406: REG1.2 D2.C
  Bottom 0.406: D2.C 25.4,34.29 L1.1
N$87
  Top 0.406: R20.2 REG1.1 REG1.8 REG1.7
N$88
  Top 0.406: R18.2 R19.1 REG1.5
N$89
  Top 0.406: R16.2 26.67,58.42 J1.6
N$90
  Bottom 0.406: REG1.3 26.67,43.18 C11.1
N$91
  Top 0.406: REG4.2 D4.C 109.22,34.29 L4.1
N$92
  Bottom 0.406: REG2.2 D1.C 53.34,34.29 L2.1
N$93
  Top 0.406: REG2.1 R23.2 | REG2.7 REG2.8
  Bottom 0.406: REG2.8 REG2.1
N$94
  Top 0.406: R22.1 REG2.5
  Bottom 0.406: R22.1 R21.2
N$95  (via drill 0.81)
  Top 0.406: v56.52,36.51 57.15,37.15 C14.1
  Bottom 0.406: REG2.3 48.58,36.51 v56.52,36.51
N$96
  Top 0.406: R29.2 REG4.1 REG4.8 REG4.7
N$97
  Top 0.406: REG3.2 D3.C 81.28,34.29 L3.1
N$98
  Top 0.406: R26.2 REG3.1 REG3.8 REG3.7
N$99
  Top 0.406: R24.2 R25.1 REG3.5
N$100
  Top 0.406: REG3.3 85.09,36.83 C17.1
N$101
  Top 0.406: REG5.2 D5.C 137.16,34.29 L5.1
N$102
  Bottom 0.406: REG4.3 107.63,40.32 108.27,40.32 111.12,43.18 C20.1
N$103
  Top 0.406: REG5.1 R30.2 | REG5.7 REG5.8
  Bottom 0.406: REG5.8 REG5.1
N$104
  Bottom 0.406: REG5.3 138.43,43.18 C23.1
N$105
  Top 0.406: R28.2 R31.1 REG5.5
N$106
  Top 0.813: J1.2 21.27,56.2 21.27,40.32 23.81,37.78 23.81,32.7 24.45,32.07 24.45,15.56 20.32,11.43 UUT.5
N$107
  Top 0.406: R1.1 132.08,55.88 IC1.28
PROBE1  (via drill 0.81)
  Top 0.406: v36.2,66.04 37.15,65.09 37.15,50.16 36.83,49.85 36.83,35.88 39.37,33.34 39.37,31.43 v41.59,29.21
  Bottom 0.406: v36.2,66.04 IC5.25 | v41.59,29.21 42.86,27.94 101.92,27.94 104.46,25.4 PROBE1.1
PROBE2  (via drill 0.81)
  Top 0.406: IC5.26 38.1,60.96 38.1,51.12 40.64,48.58 v40.64,41.91
  Bottom 0.406: v40.64,41.91 41.91,40.64 60.64,40.64 68.26,33.02 PROBE2.1
PROBE3  (via drill 0.81)
  Top 0.406: IC5.27 39.37,59.69 v39.37,53.66
  Bottom 0.406: v39.37,53.66 40.96,52.07 142.88,52.07 146.05,48.9 146.05,40.64 PROBE3.1
PROBE4  (via drill 0.81)
  Top 0.406: v70.48,56.2 71.75,54.93 v71.75,50.8
  Bottom 0.406: IC5.28 42.86,56.2 v70.48,56.2 | v71.75,50.8 142.24,50.8 PROBE4.1
SI/GPIO10  (via drill 0.81)
  Top 0.406: v23.5,81.28 26.67,84.45 v26.67,85.72
  Bottom 0.406: 115.57,90.17 95.25,90.17 IC3.13 87.95,88.9 86.68,90.17 69.85,90.17 | IC2.13 115.57,90.17 | IC1.13 138.43,90.17 115.57,90.17 | 69.85,90.17 49.53,90.17 IC5.13 46.99,87.63 28.57,87.63 v26.67,85.72 | IC4.13 69.85,90.17 | RASPI.19 10.16,81.28 v23.5,81.28
SO/GPIO9  (via drill 0.81)
  Top 0.406: v50.16,93.34 IC5.14
  Bottom 0.406: v50.16,93.34 50.8,92.71 64.14,92.71 65.41,91.44 IC4.14 72.39,92.71 92.71,92.71 | 92.71,92.71 IC3.14 | 115.57,92.71 IC2.14 | 92.71,92.71 115.57,92.71 | IC1.14 138.43,92.71 115.57,92.71 | RASPI.21 6.35,82.55 4.45,82.55 3.81,83.19 3.81,90.17 12.06,90.17 15.88,93.98 36.51,93.98 40.32,90.17 46.99,90.17 IC5.14
V-
  Top 0.813: V-.8 V-.7 V-.6 V-.5 V-.4 V-.3 V-.2
  Bottom 0.813: UUT.3 24.77,6.67 22.86,8.57 18.1,8.57 18.1,11.75 15.56,14.29 3.49,14.29 3.49,20.95 4.45,21.91 5.08,21.91 -V.1 5.08,28.26 1.59,31.75 1.59,146.05 9.53,146.05 13.34,149.86 66.99,149.86 69.53,147.32 69.53,129.54 | SV2.1 63.5,129.54 69.53,129.54 | 69.53,129.54 77.79,129.54 80.49,126.84 | 80.49,126.84 85.41,121.92 V-.1 V-.2 | SV1.1 80.64,127 80.49,126.84
VCC
  Top 0.813: RASPI.4 RASPI.2 | C21.+ 129.54,46.99 137.16,39.37 L5.2
  Bottom 0.813: C21.+ 123.19,48.26 R31.2 121.6,49.53 118.11,46.04 29.53,46.04 16.83,58.74 11.11,58.74 11.11,57.15 8.26,54.29 6.67,54.29 RASPI.2
VDD  (via drill 0.81)
  Top 0.813: IC4.17 IC4.16 IC4.15 | IC5.15 IC5.16 IC5.17 42.23,84.77 42.23,79.69 v43.18,78.74 43.18,78.42 42.23,77.47 42.23,53.34 C2.1 41.91,42.86 42.86,41.91 42.86,17.78 PWR.A | IC2.17 IC2.16 IC2.15 | IC3.17 IC3.16 IC3.15 | R25.2 64.77,50.8 C3.1 | 72.55,77.31 73.03,76.83 73.03,55.88 | 72.55,77.31 IC4.9 71.12,79.06 67.94,82.23 v67.94,85.09 | 73.03,55.88 73.03,48.9 C15.+ 73.66,47.94 78.42,43.18 78.42,42.55 81.28,39.69 L3.2 81.28,39.37 82.23,40.32 82.23,47.94 C4.1 | 73.03,55.88 85.72,55.88 88.9,59.05 88.9,73.66 IC3.9 93.98,79.06 95.57,80.64 95.57,84.45 v96.2,85.09 | v73.66,85.09 72.71,84.14 72.71,77.47 72.55,77.31 | IC1.15 IC1.16 IC1.17 | IC2.9 119.06,80.96 v119.06,85.09 | C6.1 135.89,55.88 135.89,77.47 v137.16,78.74 137.16,83.5 v135.89,84.77
  Bottom 0.813: v43.18,78.74 IC5.9 | IC4.15 50.16,91.44 48.58,93.03 42.23,93.03 IC5.15 | R25.2 67.31,48.26 C15.+ | IC3.17 85.09,85.09 v73.66,85.09 | IC2.17 107.95,85.09 v96.2,85.09 | v119.06,85.09 120.33,86.36 IC1.17 132.4,86.36 133.99,84.77 v135.89,84.77 | 109.06,54.77 108.9,54.93 89.22,54.93 C4.1 | 109.06,54.77 C5.1 | C6.1 131.76,54.93 109.22,54.93 109.06,54.77 | v137.16,78.74 IC1.9 | IC4.17 64.77,85.09 v67.94,85.09
VPP  (via drill 0.81)
  Top 0.813: R17.2 80.01,64.77 V+.8 V+.7 V+.6 V+.5 V+.4 V+.3 V+.2 V+.1 80.01,124.14 v84.14,128.27 | R6.2 R7.2 R8.2 R9.2 129.54,23.18 127.32,25.4 127.32,53.34 R1.2
  Bottom 0.813: BX2.2 70.17,121.92 71.75,123.51 73.03,123.51 74.61,121.92 V+.1 | AX2.2 142.24,124.46 142.88,124.46 143.51,125.09 | 143.51,125.09 143.51,128.59 116.52,128.59 116.2,128.27 v84.14,128.27 | VPP0.1 12.7,20.32 UUT_PWR.A 15.56,17.78 20,13.34 26.67,13.34 26.83,13.18 | 26.83,13.18 25.08,11.43 UUT.6 | 26.83,13.18 27.94,14.29 40.32,14.29 C1.+ 42.23,12.7 45.09,9.84 139.06,9.84 146.37,17.14 146.37,22.86 | R6.2 146.37,22.86 | 143.51,125.09 143.83,125.09 147.32,121.6 148.59,121.6 149.22,120.97 149.22,23.18 146.37,23.18 146.37,22.86
VSS  (via drill 0.81)
  Top 0.813: 9.05,87.79 9.21,87.95 9.21,102.55 RASPI.39 7.3,104.14 5.71,105.73 3.49,105.73 3.49,94.93 | 9.05,87.79 RASPI.25 | 3.49,94.93 3.49,93.03 RASPI.30 5.08,91.12 3.49,89.53 3.49,77.47 3.65,77.31 | RASPI.34 3.49,94.93 | RASPI.6 3.49,62.55 3.49,69.53 | RASPI.14 3.49,69.53 | 3.65,77.31 3.49,77.15 3.49,69.53 | 3.65,77.31 RASPI.20 | RASPI.9 9.21,67.63 9.21,87.63 9.05,87.79 | REG3.4 73.66,41.91 C15.- 73.66,43.5 69.85,47.31 69.85,47.94 | 69.85,47.94 65.09,47.94 R24.1 63.18,49.53 v59.37,53.34 59.37,54.29 53.34,60.33 53.34,78.74 v50.8,81.28 | 69.85,47.94 C3.2 69.85,53.66 66.67,56.83 66.67,86.36 68.58,86.36 69.22,85.72 69.22,83.19 IC4.10 | GNDL0.1 R2.1 | GNDL3.1 R5.1 | GNDL2.1 R4.1 | GNDL1.1 R3.1 78.74,13.02 80.33,14.61 80.33,25.72 D3.A 86.36,32.07 88.27,33.97 88.27,48.9 C4.2 | C21.- 129.54,41.91 REG5.4 134.62,39.37 D5.A | C23.2 135.89,50.8 C6.2 138.43,53.66 141.29,56.52 141.29,79.69 IC1.10 | C5.2 R28.1 | v115.25,67.31 115.25,53.34 C5.2 | C4.2 96.52,53.34 C18.+ 101.6,46.99 105.25,43.34 | v91.12,72.39 92.39,71.12 92.39,54.93 | 92.39,54.93 92.39,53.34 C4.2 | 105.25,43.34 109.22,39.37 L4.2 | C5.2 114.94,53.34 105.41,43.81 105.41,43.5 105.25,43.34 | C17.2 80.96,44.13 80.96,48.58 87.31,54.93 92.39,54.93
  Bottom 0.813: RASPI.9 19.05,66.04 J1.5 24.45,60.96 32.38,53.02 38.1,53.02 40.64,50.48 62.55,50.48 R24.1 | C15.- C17.2 | v59.37,53.34 C2.2 | v50.8,81.28 IC5.10 | R14.1 58.42,12.7 R2.1 R3.1 R4.1 R5.1 | REG5.4 C23.2 | IC2.10 115.25,79.69 v115.25,67.31 | IC3.10 91.76,81.28 91.12,80.64 v91.12,72.39 | C21.- 127.32,40.96 110.81,40.96 109.22,39.37 L4.2
VSSCTL  (via drill 0.81)
  Top 0.406: R15.1 R16.1 | REG4.5 R27.2 91.44,31.11 v90.81,30.48
  Bottom 0.406: R16.1 8.89,50.8 7.3,50.8 5.08,48.58 5.08,30.48 v90.81,30.48

## Text on the board
Top: - | ON
tPlace: BV | BA | AV | AA | M | R | M/R Series Flip-Chip Tester | Based on design by Warren Stearns